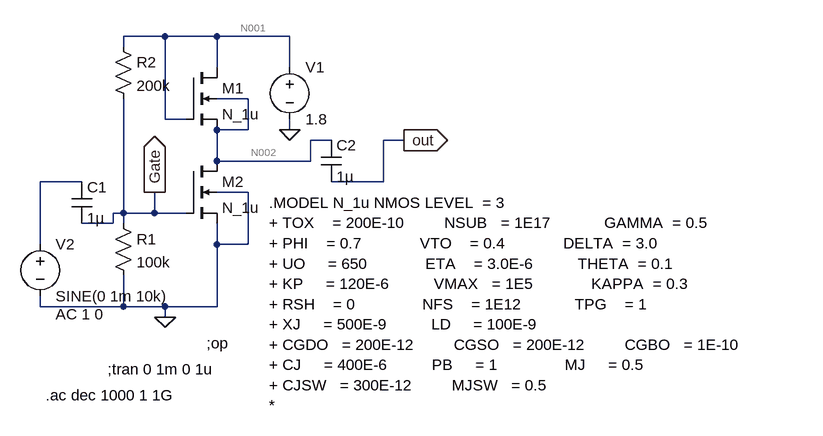
[diagram p0: schematic commonsource_diodeload.asc]
commonsource_diodeload.asc, the LTspice schematic file:
Version 4
SHEET 1 1148 680
WIRE 128 0 64 0
WIRE 208 0 128 0
WIRE 320 0 208 0
WIRE 64 16 64 0
WIRE 208 48 208 0
WIRE 320 48 320 0
WIRE 256 96 208 96
WIRE 128 128 128 0
WIRE 160 128 128 128
WIRE 256 144 256 96
WIRE 256 144 208 144
WIRE 320 144 320 128
WIRE 384 160 352 160
WIRE 496 160 464 160
WIRE 208 192 208 144
WIRE 352 192 352 160
WIRE 352 192 208 192
WIRE 0 224 -64 224
WIRE 464 224 464 160
WIRE 464 224 384 224
WIRE 256 240 208 240
WIRE 64 272 64 96
WIRE 64 272 48 272
WIRE 112 272 112 240
WIRE 112 272 64 272
WIRE 160 272 112 272
WIRE 48 288 48 272
WIRE 48 288 0 288
WIRE 64 288 64 272
WIRE -64 320 -64 224
WIRE 208 320 208 288
WIRE 256 320 256 240
WIRE 256 320 208 320
WIRE -64 416 -64 400
WIRE 64 416 64 368
WIRE 64 416 -64 416
WIRE 128 416 64 416
WIRE 208 416 208 320
WIRE 208 416 128 416
WIRE 128 432 128 416
FLAG 128 432 0
FLAG 320 144 0
FLAG 112 240 Gate
IOPIN 112 240 Out
FLAG 496 160 out
IOPIN 496 160 Out
SYMBOL nmos4 160 48 R0
SYMATTR InstName M1
SYMATTR Value N_1u
SYMATTR Value2 l=50u w=50u
SYMBOL nmos4 160 192 R0
SYMATTR InstName M2
SYMATTR Value N_1u
SYMATTR Value2 l=10u w=216u
SYMBOL res 48 272 R0
SYMATTR InstName R1
SYMATTR Value 100k
SYMBOL res 48 0 R0
SYMATTR InstName R2
SYMATTR Value 200k
SYMBOL voltage 320 32 R0
WINDOW 123 0 0 Left 0
WINDOW 39 0 0 Left 0
SYMATTR InstName V1
SYMATTR Value 1.8
SYMBOL voltage -64 304 R0
WINDOW 123 24 124 Left 2
WINDOW 39 0 0 Left 0
SYMATTR Value2 AC 1 0
SYMATTR InstName V2
SYMATTR Value SINE(0 1m 10k)
SYMBOL cap -16 224 R0
SYMATTR InstName C1
SYMATTR Value 1µ
SYMBOL cap 368 160 R0
SYMATTR InstName C2
SYMATTR Value 1µ
TEXT 192 472 Left 2 !;op
TEXT 288 256 Left 2 !.MODEL N_1u NMOS LEVEL  = 3                  \n+ TOX    = 200E-10         NSUB   = 1E17            GAMMA  = 0.5          \n+ PHI    = 0.7             VTO    = 0.4             DELTA  = 3.0         \n+ UO     = 650             ETA    = 3.0E-6          THETA  = 0.1          \n+ KP     = 120E-6          VMAX   = 1E5             KAPPA  = 0.3                \n+ RSH    = 0               NFS    = 1E12            TPG    = 1                  \n+ XJ     = 500E-9          LD     = 100E-9                 \n+ CGDO   = 200E-12         CGSO   = 200E-12         CGBO   = 1E-10              \n+ CJ     = 400E-6          PB     = 1               MJ     = 0.5           \n+ CJSW   = 300E-12         MJSW   = 0.5                                  \n*
TEXT 40 512 Left 2 !;tran 0 1m 0 1u
TEXT -56 552 Left 2 !.ac dec 1000 1 1G

The netlist it stands for:
* commonsource_diodeload.asc
M1 N001 N001 N002 N002 N_1u l=50u w=50u
M2 N002 Gate 0 0 N_1u l=10u w=216u
R1 Gate 0 100k
R2 N001 Gate 200k
V1 N001 0 1.8
V2 N003 0 SINE(0 1m 10k) AC 1 0
C1 N003 Gate 1µ
C2 N002 out 1µ
.model NMOS NMOS
.model PMOS PMOS
.lib standard.mos
;op
.MODEL N_1u NMOS LEVEL  = 3
+ TOX    = 200E-10         NSUB   = 1E17            GAMMA  = 0.5
+ PHI    = 0.7             VTO    = 0.4             DELTA  = 3.0
+ UO     = 650             ETA    = 3.0E-6          THETA  = 0.1
+ KP     = 120E-6          VMAX   = 1E5             KAPPA  = 0.3
+ RSH    = 0               NFS    = 1E12            TPG    = 1
+ XJ     = 500E-9          LD     = 100E-9
+ CGDO   = 200E-12         CGSO   = 200E-12         CGBO   = 1E-10
+ CJ     = 400E-6          PB     = 1               MJ     = 0.5
+ CJSW   = 300E-12         MJSW   = 0.5
*
;tran 0 1m 0 1u
.ac dec 1000 1 1G
.backanno
.end

* Results of the author's LTspice run, read from the files saved beside the schematic
* Operating Point, zero values left out:
*   V(n001) = 1.8 V
*   V(n002) = 405.2 mV
*   V(gate) = 600 mV
*   V(out) = 405.2 nV
*   Id(M2) = 46.21 µA
*   Is(M2) = -46.21 µA
*   Id(M1) = 46.21 µA
*   Ib(M1) = -1.405 pA
*   Is(M1) = -46.21 µA
*   I(R2) = 6 µA
*   I(R1) = 6 µA
*   I(V1) = -52.21 µA
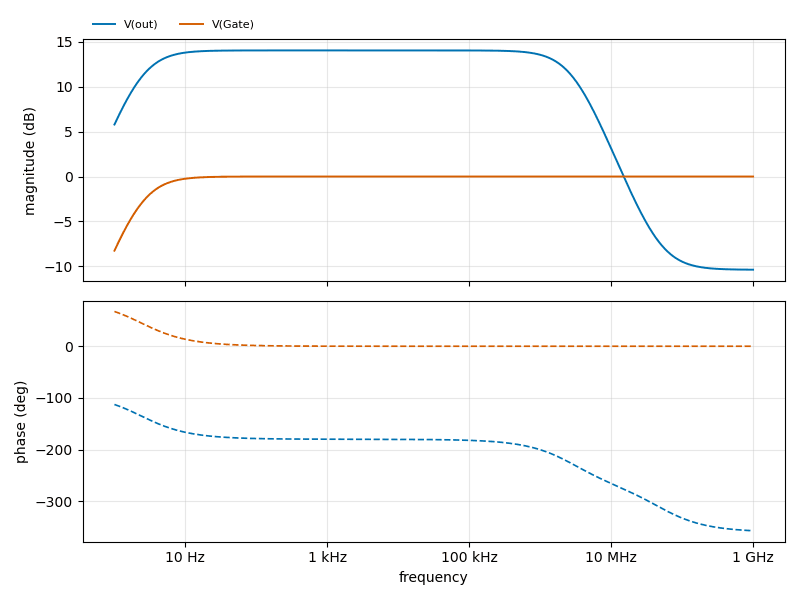
[diagram p1: AC Analysis of commonsource_diodeload.asc, plotted from the saved traces]
* AC Analysis, 1 run:
*   V(out): 5.79 dB at 1 Hz, -10.38 dB at 1 GHz, peak 14.05 dB at 2.63 kHz, 3 dB below the peak at 2.387 Hz and 2.907 MHz
*   V(Gate): -8.26 dB at 1 Hz, -0.00 dB at 1 GHz, peak -0.00 dB at 1 GHz, 3 dB below the peak at 2.387 Hz